# EAGLE design ESP32-S2_VoiceModulator (EAGLE 9.6.2)

## Sheet 1 of 4: ESP32-S2
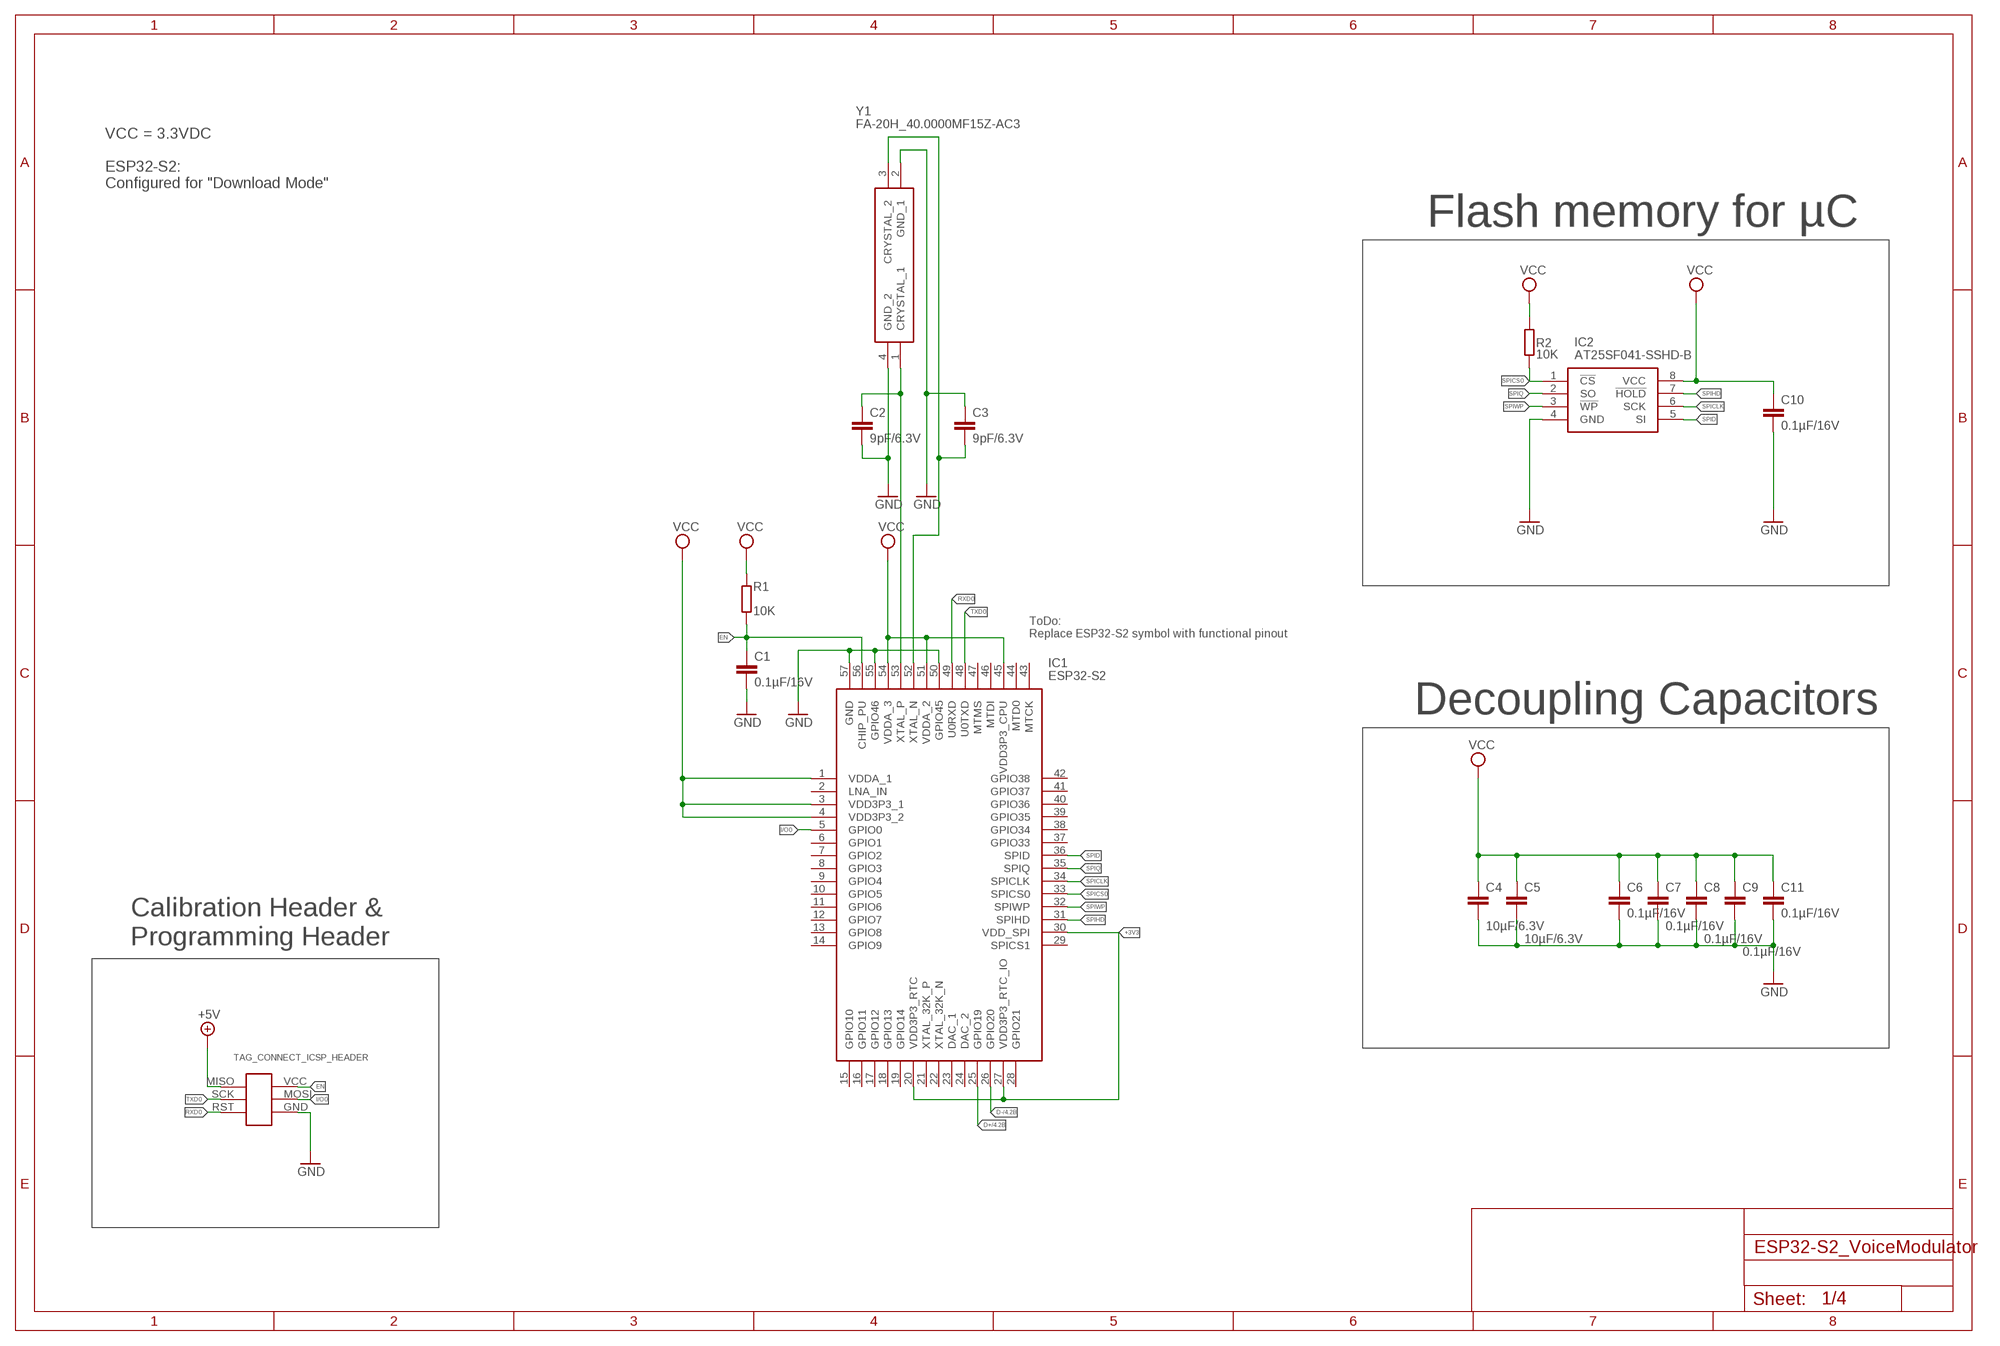
[diagram p0: schematic, sheet 1]

### Parts
C1  0.1µF/16V  C-EUC0402  [C0402]
C2  9pF/6.3V  C-EUC0603  [C0603]
C3  9pF/6.3V  C-EUC0603  [C0603]
C4  10µF/6.3V  C-EUC0603  [C0603]
C5  10µF/6.3V  C-EUC0603  [C0603]
C6  0.1µF/16V  C-EUC0402  [C0402]
C7  0.1µF/16V  C-EUC0402  [C0402]
C8  0.1µF/16V  C-EUC0402  [C0402]
C9  0.1µF/16V  C-EUC0402  [C0402]
C10  0.1µF/16V  C-EUC0402  [C0402]
C11  0.1µF/16V  C-EUC0402  [C0402]
IC1  ESP32-S2  [QFN40P700X700X90-57N]
IC2  AT25SF041-SSHD-B  [SOIC127P600X175-8N]
R1  10K  R-EU_R0603  [R0603]
R2  10K  R-EU_R0603  [R0603]
TAG_CONNECT_ICSP_HEADER  TAG-CONNECT_PADS  [TAG-CONNECT_PADS]
Y1  FA-20H_40.0000MF15Z-AC3  [FA20H160000MF12ZAC3]

### Nets
+3V3: IC1.20(VDD3P3_RTC) IC1.27(VDD3P3_RTC_IO) IC1.30(VDD_SPI)
+5V: TAG_CONNECT_ICSP_HEADER.MISO ; also sheet 3,4
D+: IC1.25(GPIO19) ; also sheet 4
D-: IC1.26(GPIO20) ; also sheet 4
EN: C1.1 IC1.56(CHIP_PU) R1.1 TAG_CONNECT_ICSP_HEADER.VCC
GND: C1.2 C2.2 C3.1 C4.2 C5.2 C6.2 C7.2 C8.2 C9.2 C10.2 C11.2 IC1.50(GPIO45) IC1.55(GPIO46) IC1.57(GND) IC2.4(GND) TAG_CONNECT_ICSP_HEADER.GND Y1.2(GND_1) Y1.4(GND_2) ; also sheet 2,3,4
I/O0: IC1.5(GPIO0) TAG_CONNECT_ICSP_HEADER.MOSI
N$32: C2.1 IC1.53(XTAL_P) Y1.1(CRYSTAL_1)
N$33: C3.2 IC1.52(XTAL_N) Y1.3(CRYSTAL_2)
RXD0: IC1.49(U0RXD) TAG_CONNECT_ICSP_HEADER.RST
SPICLK: IC1.34(SPICLK) IC2.6(SCK)
SPICS0: IC1.33(SPICS0) IC2.1(!CS) R2.1
SPID: IC1.36(SPID) IC2.5(SI)
SPIHD: IC1.31(SPIHD) IC2.7(!HOLD)
SPIQ: IC1.35(SPIQ) IC2.2(SO)
SPIWP: IC1.32(SPIWP) IC2.3(!WP)
TXD0: IC1.48(U0TXD) TAG_CONNECT_ICSP_HEADER.SCK
VCC: C4.1 C5.1 C6.1 C7.1 C8.1 C9.1 C10.1 C11.1 IC1.1(VDDA_1) IC1.3(VDD3P3_1) IC1.4(VDD3P3_2) IC1.45(VDD3P3_CPU) IC1.51(VDDA_2) IC1.54(VDDA_3) IC2.8(VCC) R1.2 R2.2 ; also sheet 3,4
Unconnected: IC1.2(LNA_IN) IC1.6(GPIO1) IC1.7(GPIO2) IC1.8(GPIO3) IC1.9(GPIO4) IC1.10(GPIO5) IC1.11(GPIO6) IC1.12(GPIO7) IC1.13(GPIO8) IC1.14(GPIO9) IC1.15(GPIO10) IC1.16(GPIO11) IC1.17(GPIO12) IC1.18(GPIO13) IC1.19(GPIO14) IC1.21(XTAL_32K_P) IC1.22(XTAL_32K_N) IC1.23(DAC_1) IC1.24(DAC_2) IC1.28(GPIO21) IC1.29(SPICS1) IC1.37(GPIO33) IC1.38(GPIO34) IC1.39(GPIO35) IC1.40(GPIO36) IC1.41(GPIO37) IC1.42(GPIO38) IC1.43(MTCK) IC1.44(MTD0) IC1.46(MTDI) IC1.47(MTMS)

### Notes on the sheet
- VCC = 3.3VDC
  
  ESP32-S2:
  Configured for "Download Mode"
- Flash memory for µC
- ToDo:
  Replace ESP32-S2 symbol with functional pinout
- Decoupling Capacitors
- Calibration Header & 
  Programming Header

## Sheet 2 of 4: Analog
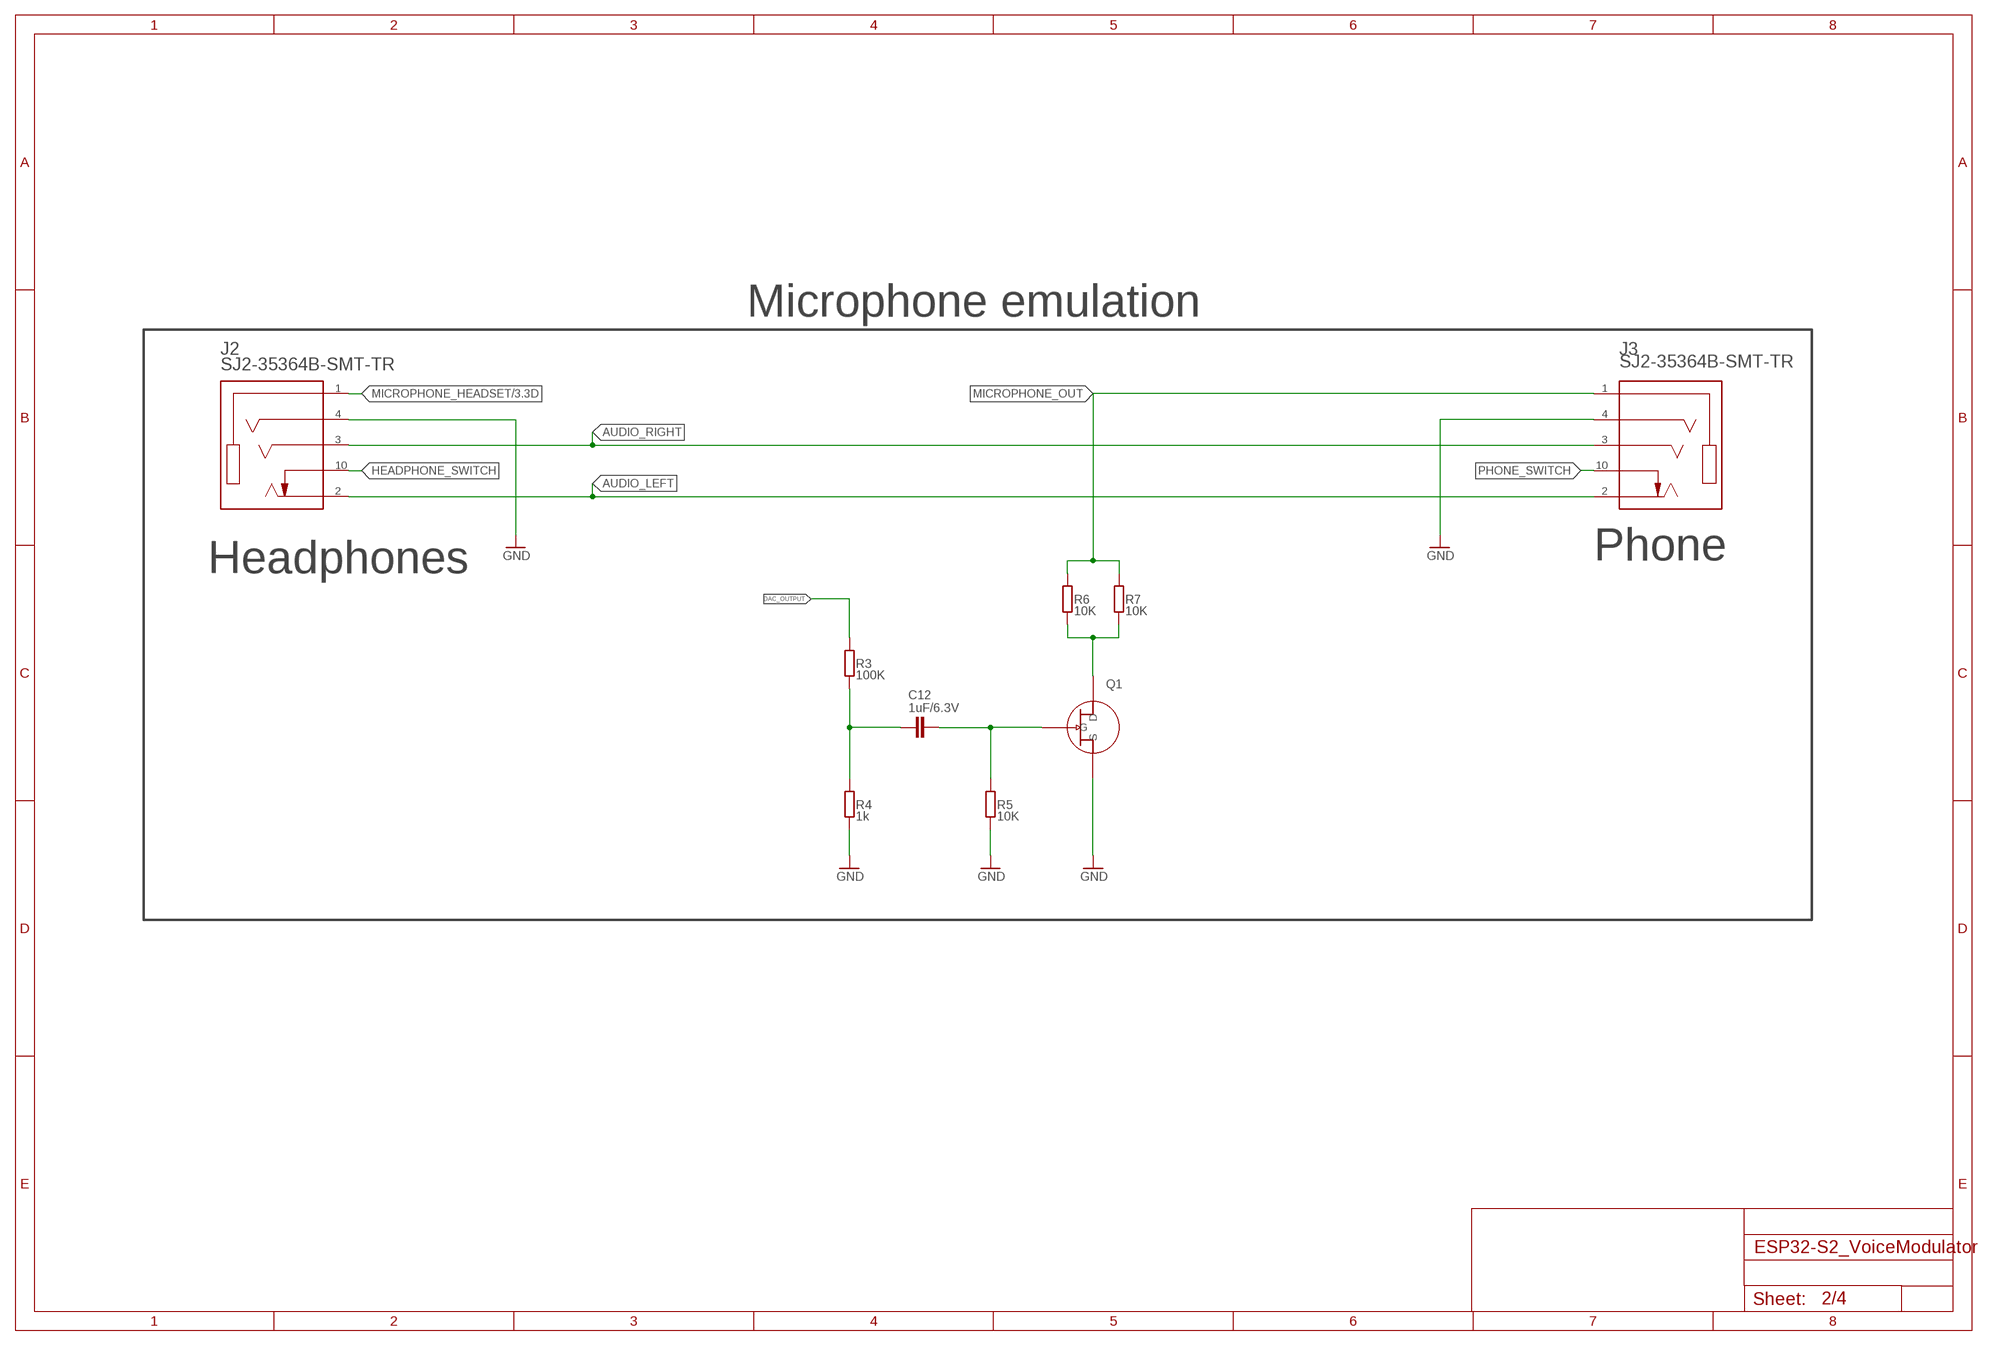
[diagram p1: schematic, sheet 2]

### Parts
C12  1uF/6.3V  C-EUC0603  [C0603]
J2  SJ2-35364B-SMT-TR  [SJ2-35364B-SMT-TR]
J3  SJ2-35364B-SMT-TR  [SJ2-35364B-SMT-TR]
Q1  CPH3910  [SOT-23-3]
R3  100K  R-EU_R0603  [R0603]
R4  1k  R-EU_R0603  [R0603]
R5  10K  R-EU_R0603  [R0603]
R6  10K  R-EU_R0603  [R0603]
R7  10K  R-EU_R0603  [R0603]

### Nets
AUDIO_LEFT: J2.2 J3.2
AUDIO_RIGHT: J2.3 J3.3
DAC_OUTPUT: R3.2
GND: J2.4 J3.4 Q1.P$1(S) R4.1 R5.2 ; also sheet 1,3,4
HEADPHONE_SWITCH: J2.10
MICROPHONE_HEADSET: J2.1 ; also sheet 3
MICROPHONE_OUT: J3.1 R6.1 R7.2
N$1: C12.2 Q1.P$3(G) R5.1
N$2: C12.1 R3.1 R4.2
N$5: Q1.P$2(D) R6.2 R7.1
PHONE_SWITCH: J3.10

### Notes on the sheet
- Microphone emulation
- Headphones | Phone

## Sheet 3 of 4: Microphone
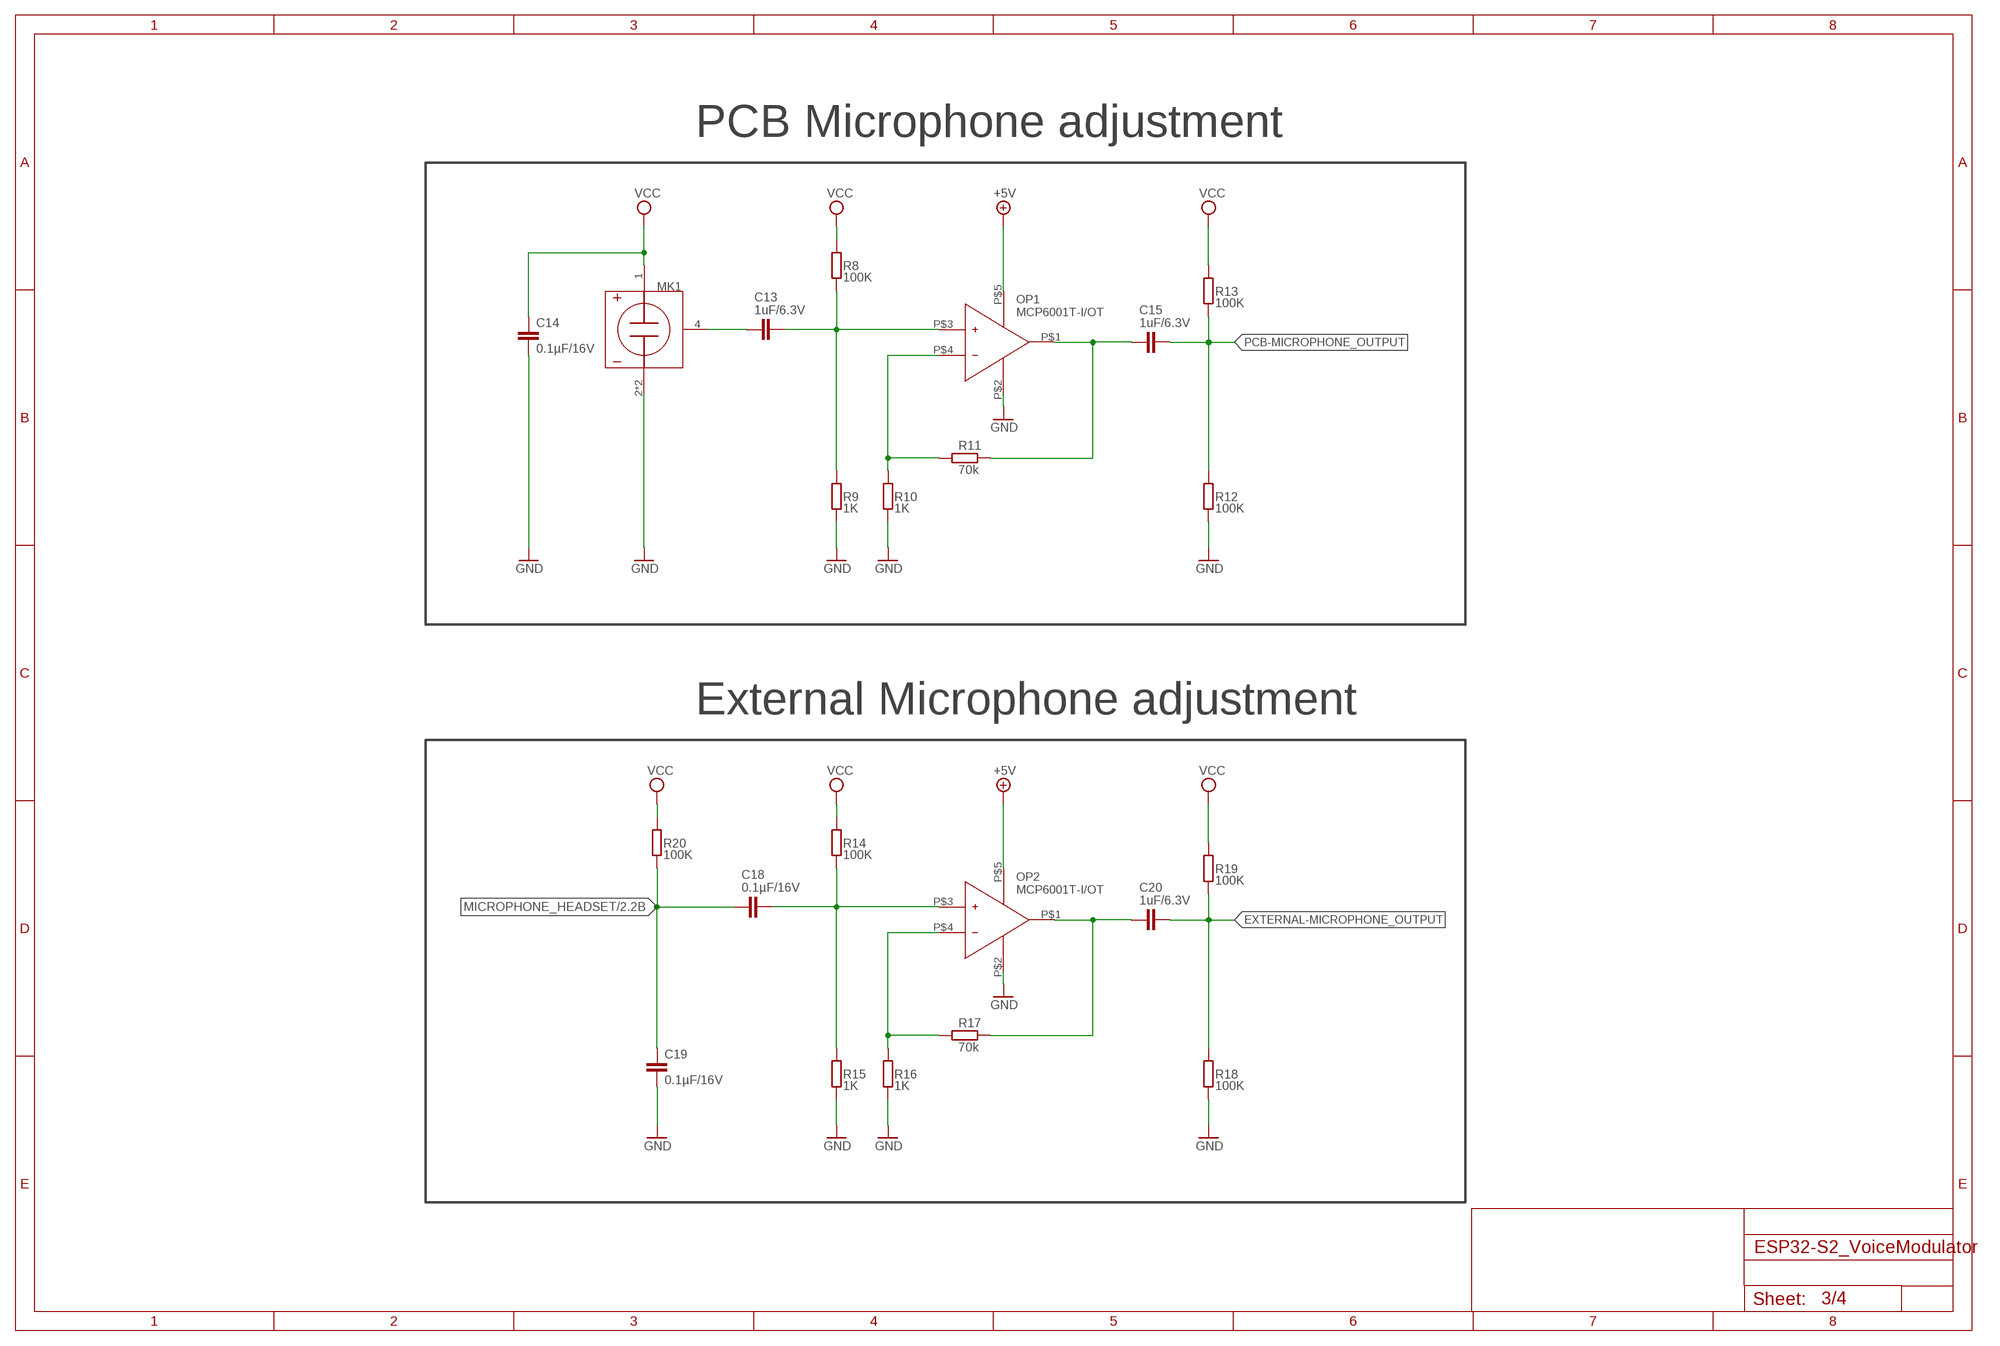
[diagram p2: schematic, sheet 3]

### Parts
C13  1uF/6.3V  C-EUC0603  [C0603]
C14  0.1µF/16V  C-EUC0402  [C0402]
C15  1uF/6.3V  C-EUC0603  [C0603]
C18  0.1µF/16V  C-EUC0603  [C0603]
C19  0.1µF/16V  C-EUC0402  [C0402]
C20  1uF/6.3V  C-EUC0603  [C0603]
MK1  WMM7022AT0  [WMM7022AT0]
OP1  MCP6001T-I/OT  [SOT-23-5]
OP2  MCP6001T-I/OT  [SOT-23-5]
R8  100K  R-EU_R0603  [R0603]
R9  1K  R-EU_R0603  [R0603]
R10  1K  R-EU_R0603  [R0603]
R11  70k  R-EU_R0603  [R0603]
R12  100K  R-EU_R0603  [R0603]
R13  100K  R-EU_R0603  [R0603]
R14  100K  R-EU_R0603  [R0603]
R15  1K  R-EU_R0603  [R0603]
R16  1K  R-EU_R0603  [R0603]
R17  70k  R-EU_R0603  [R0603]
R18  100K  R-EU_R0603  [R0603]
R19  100K  R-EU_R0603  [R0603]
R20  100K  R-EU_R0603  [R0603]

### Nets
+5V: OP1.P$5(VDD) OP2.P$5(VDD) ; also sheet 1,4
EXTERNAL-MICROPHONE_OUTPUT: C20.2 R18.2 R19.1
GND: C14.2 C19.2 MK1.2(GND) MK1.3(GND) OP1.P$2(VSS) OP2.P$2(VSS) R9.1 R10.1 R12.1 R15.1 R16.1 R18.1 ; also sheet 1,2,4
MICROPHONE_HEADSET: C18.1 C19.1 R20.1 ; also sheet 2
N$3: C13.2 OP1.P$3(V+) R8.1 R9.2
N$4: C13.1 MK1.4(OUT)
N$6: OP1.P$4(V-) R10.2 R11.2
N$7: C15.1 OP1.P$1(VOUT) R11.1
N$9: C18.2 OP2.P$3(V+) R14.1 R15.2
N$10: OP2.P$4(V-) R16.2 R17.2
N$11: C20.1 OP2.P$1(VOUT) R17.1
PCB-MICROPHONE_OUTPUT: C15.2 R12.2 R13.1
VCC: C14.1 MK1.1(VDD) R8.2 R13.2 R14.2 R19.2 R20.2 ; also sheet 1,4

### Notes on the sheet
- PCB Microphone adjustment
- External Microphone adjustment

## Sheet 4 of 4: Power
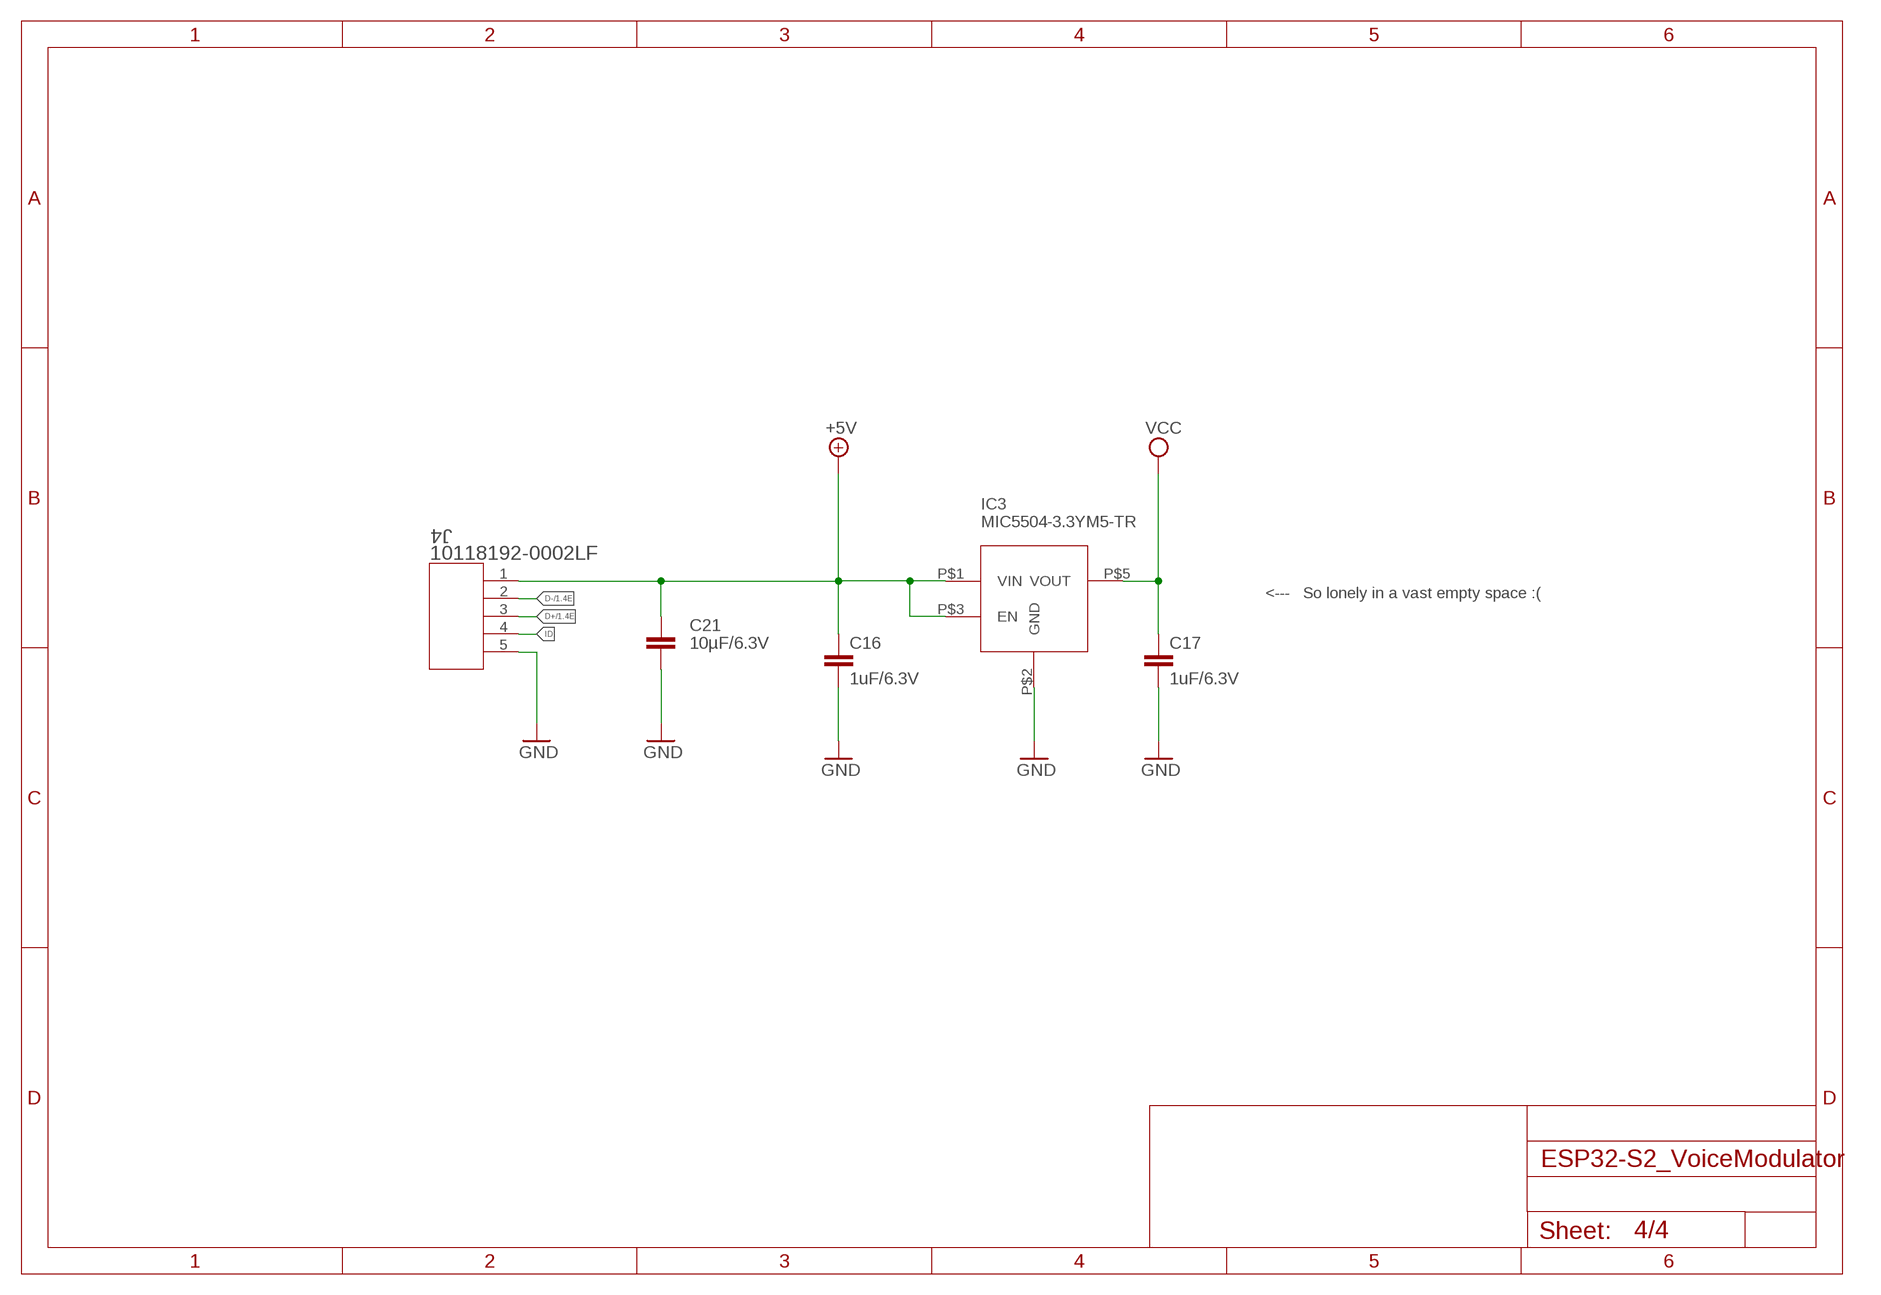
[diagram p3: schematic, sheet 4]

### Parts
C16  1uF/6.3V  C-EUC0603  [C0603]
C17  1uF/6.3V  C-EUC0603  [C0603]
C21  10µF/6.3V  C-EUC0603  [C0603]
IC3  MIC5504-3.3YM5-TR  [SOT-23-5]
J4  10118192-0002LF  [CONN_10118192-0002LF_AMP]

### Nets
+5V: C16.1 C21.1 IC3.P$1(VIN) IC3.P$3(EN) J4.1 ; also sheet 1,3
D+: J4.3 ; also sheet 1
D-: J4.2 ; also sheet 1
GND: C16.2 C17.2 C21.2 IC3.P$2(GND) J4.5 ; also sheet 1,2,3
ID: J4.4
VCC: C17.1 IC3.P$5(VOUT) ; also sheet 1,3

### Notes on the sheet
- <---   So lonely in a vast empty space :(

## Library data of the parts
C1-C11 C14 C19 C21 = rcl:C-EU: CAPACITOR, European symbol; SPICEPREFIX: C
C12 C13 C15-C18 C20 = resistor:C-EU: CAPACITOR, European symbol
IC1 = SamacSys_Parts:ESP32-S2: SMD WI-FI IC, ESP32-S2, SINGAL-C Source: Datasheet <https://componentsearchengine.com/Datasheets/1/ESP32-S2.pdf>; ARROW_PART_NUMBER: ESP32-S2; DESCRIPTION: SMD WI-FI IC, ESP32-S2, SINGAL-C; HEIGHT: 0.9mm; MANUFACTURER_NAME: Espressif Systems; MANUFACTURER_PART_NUMBER: ESP32-S2; MOUSER_PART_NUMBER: 356-ESP32-S2; MOUSER_PRICE-STOCK: https://www.mouser.co.uk/ProductDetail/Espressif-Systems/ESP32-S2?qs=GBLSl2Akirtmlui%2FgtDaSQ%3D%3D
IC2 = SamacSys_Parts:AT25SF041-SSHD-B: 4-Mbit 2.5V SPI Flash Memory Source: Datasheet <http://uk.rs-online.com/web/p/products/8228473P>; ARROW_PART_NUMBER: AT25SF041-SSHD-B; ARROW_PRICE-STOCK: https://www.arrow.com/en/products/at25sf041-sshd-b/adesto-technologies-corporation-inc; DESCRIPTION: 4-Mbit 2.5V SPI Flash Memory; HEIGHT: 1.75mm; MANUFACTURER_NAME: Adesto Technologies; MANUFACTURER_PART_NUMBER: AT25SF041-SSHD-B; MOUSER_PART_NUMBER: 988-AT25SF041-SSHD-B; MOUSER_PRICE-STOCK: https://www.mouser.co.uk/ProductDetail/Adesto-Technologies/AT25SF041-SSHD-B?qs=abmNkq9no6AMaDbJMT3DtA%3D%3D
IC3 = VoiceModulator:MIC5504-3.3YM5-TR: Linear Voltage Regulator IC 1 Output 300mA SOT-23-5
J2 = VoiceModulator:SJ2-35364B-SMT-TR: 3.5 mm, Stereo, Right Angle, Surface Mount (SMT), Audio Jack Connector Check prices; SPICEPREFIX: X
J3 = VoiceModulator:SJ2-35364B-SMT-TR: 3.5 mm, Stereo, Right Angle, Surface Mount (SMT), Audio Jack Connector Check prices
J4 = VoiceModulator:10118192-0002LF; BUILT_BY: EMA_Cory; COPYRIGHT: Copyright (C) 2018 Accelerated Designs. All rights reserved; DATASHEET: https://www.amphenol-icc.com/media/wysiwyg/files/drawing/10118192.pdf; MANUFACTURER_PART_NUMBER: 10118192-0002LF; SOURCELIBRARY: Amphenol_ICC_2020-05-19; VENDOR: Amphenol
MK1 = VoiceModulator:WMM7022AT0: 3.76*2.24*1.1 Electret Condenser Microphone RoHS
OP1 OP2 = VoiceModulator:MCP6001T-I/OT: General Purpose Amplifier 1 Circuit Rail-to-Rail SOT-23-5
Q1 = VoiceModulator:CPH3910: JFET N-Channel 25V 50mA 400mW Surface Mount 3-CPH
R1-R20 = resistor:R-EU_: RESISTOR, European symbol
TAG_CONNECT_ICSP_HEADER = TAG-CONNECT_PADS-lbr:TAG-CONNECT_PADS
Y1 = SamacSys_Parts:FA-20H_40.0000MF15Z-AC3: Source: Datasheet <https://support.epson.biz/td/api/doc_check.php?dl=brief_FA-20H&lang=en>; HEIGHT: 0.55mm; MANUFACTURER_NAME: Epson Timing; MANUFACTURER_PART_NUMBER: FA-20H 40.0000MF15Z-AC3; MOUSER_PART_NUMBER: 732-FA-20H40F15Z-AC3; MOUSER_PRICE-STOCK: https://www.mouser.com/Search/Refine.aspx?Keyword=732-FA-20H40F15Z-AC3

## Board
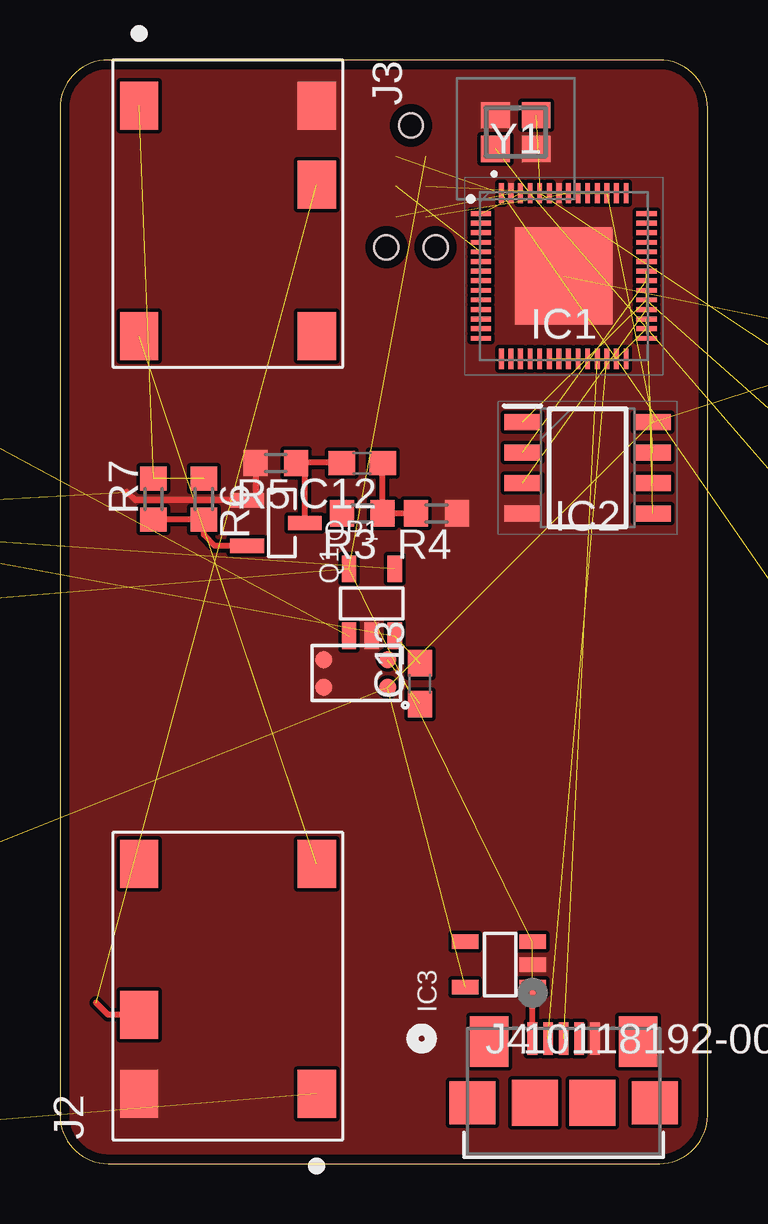
[diagram p4: board, top side]
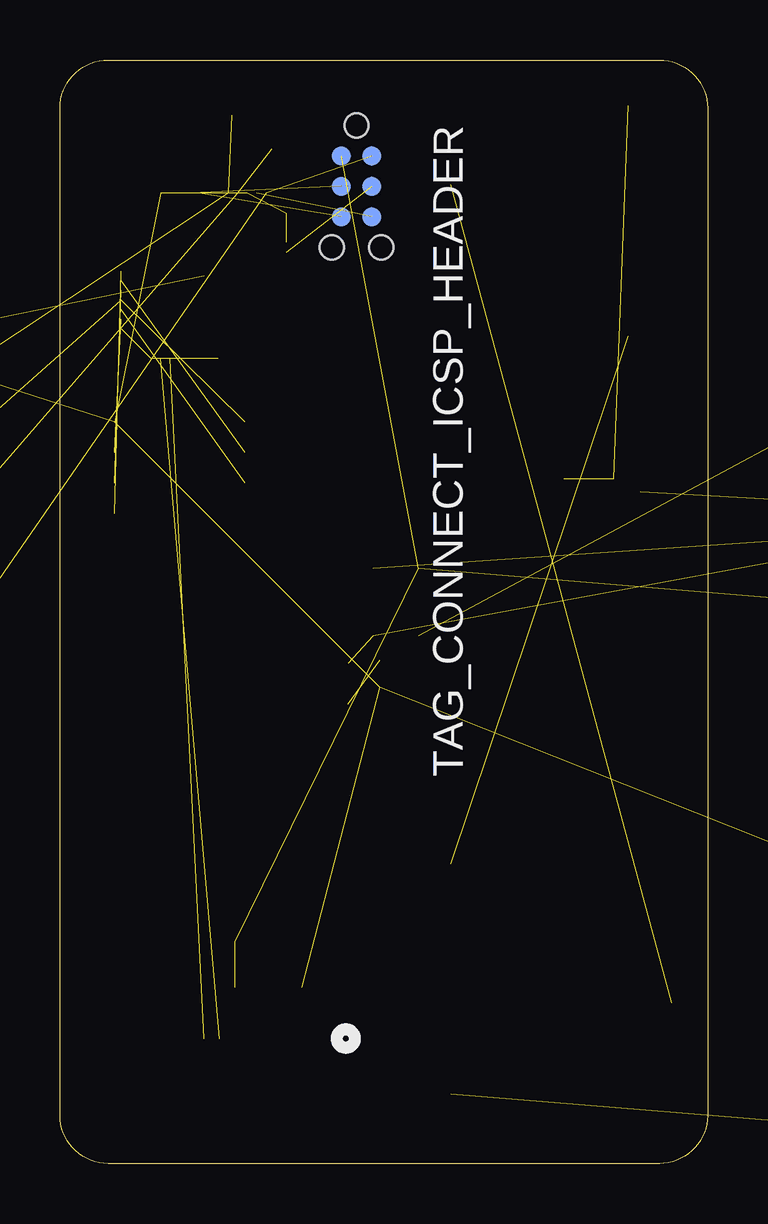
[diagram p5: board, bottom side, seen from below]

Size 27 x 46 mm. Coordinates in mm from the lower left corner, seen from the top.
Outline: 0,44 0,2 arc90 2,0 25,0 arc90 27,2 27,44 arc90 25,46 2,46 arc90 0,44
Copper layers (1+2*15+16): Top 0.035mm / dielectric 0.2mm / Route2 0.035mm / dielectric 1.5mm / Route15 0.035mm / dielectric 0.2mm / Bottom 0.035mm
Design rules "default *": minimum track width 6mil, minimum drill 0.35mm, track to track 6mil, track to pad 6mil, pad to pad 6mil, via to via 6mil, smd to smd 6mil, copper to edge 15mil, drill to drill 6mil, minimum pad ring 10mil, minimum via ring 8mil, stop-mask expansion 4mil, vias tented up to drill 20mil, thermal gap 10mil

### Footprints (pad centres in the part's own frame; a part is rotated, then mirrored left to right if it is on the bottom)
C0402 = smd 0.7 x 0.9: 1 -0.65,0; 2 0.65,0
C0603 = smd 1.1 x 1: 1 -0.85,0; 2 0.85,0
QFN40P700X700X90-57N = smd 0.85 x 0.2: 1 -3.45,2.6; 2 -3.45,2.2; 3 -3.45,1.8; 4 -3.45,1.4; 5 -3.45,1; 6 -3.45,0.6; 7 -3.45,0.2; 8 -3.45,-0.2; 9 -3.45,-0.6; 10 -3.45,-1; 11 -3.45,-1.4; 12 -3.45,-1.8; 13 -3.45,-2.2; 14 -3.45,-2.6; 29 3.45,-2.6; 30 3.45,-2.2; 31 3.45,-1.8; 32 3.45,-1.4; 33 3.45,-1; 34 3.45,-0.6; 35 3.45,-0.2; 36 3.45,0.2; 37 3.45,0.6; 38 3.45,1; 39 3.45,1.4; 40 3.45,1.8; 41 3.45,2.2; 42 3.45,2.6 | smd 0.2 x 0.85: 15 -2.6,-3.45; 16 -2.2,-3.45; 17 -1.8,-3.45; 18 -1.4,-3.45; 19 -1,-3.45; 20 -0.6,-3.45; 21 -0.2,-3.45; 22 0.2,-3.45; 23 0.6,-3.45; 24 1,-3.45; 25 1.4,-3.45; 26 1.8,-3.45; 27 2.2,-3.45; 28 2.6,-3.45; 43 2.6,3.45; 44 2.2,3.45; 45 1.8,3.45; 46 1.4,3.45; 47 1,3.45; 48 0.6,3.45; 49 0.2,3.45; 50 -0.2,3.45; 51 -0.6,3.45; 52 -1,3.45; 53 -1.4,3.45; 54 -1.8,3.45; 55 -2.2,3.45; 56 -2.6,3.45 | smd 4.05 x 4.05: 57 0,0
SOIC127P600X175-8N = smd 1.525 x 0.65: 1 -2.712,1.905; 2 -2.712,0.635; 3 -2.712,-0.635; 4 -2.712,-1.905; 5 2.712,-1.905; 6 2.712,-0.635; 7 2.712,0.635; 8 2.712,1.905
SOT-23-5 = smd 0.6 x 1.1: P$1 -0.95,0; P$2 0,0; P$3 0.95,0; P$4 0.95,2.8; P$5 -0.95,2.8
SJ2-35364B-SMT-TR = smd 2 x 1.6: 1 1.9,-3.7; 2 11.5,-3.7; 3 5.2,3.7; 4 1.9,3.7; 10 11.5,3.7
CONN_10118192-0002LF_AMP = smd 0.406 x 1.346: 1 -1.3,2.204; 2 -0.65,2.204; 3 0,2.204; 4 0.65,2.204; 5 1.3,2.204 | smd 1.6 x 2.108: 6 -3.1,2.079; 7 3.1,2.079 | smd 1.905 x 1.803: 8 -3.8,-0.471; 9 3.8,-0.471 | smd 1.905 x 1.905: 10 -1.2,-0.471; 11 1.2,-0.471
WMM7022AT0 = smd 0.7 x 0.7: 1 1.15,2.66; 2 1.15,0; 3 0,0; 4 0,2.66
SOT-23-3 = smd 0.6 x 1.4: P$1 -0.95,0; P$2 0.95,0; P$3 0,2.4
R0603 = smd 1 x 1.1: 1 -0.85,0; 2 0.85,0
TAG-CONNECT_PADS = smd 0.787 x 0.787: GND 2.54,0; MISO 0,-1.27; MOSI 1.27,0; RST 2.54,-1.27; SCK 1.27,-1.27; VCC 0,0 | hole 0.991: -1.27,-0.635; 3.81,0.394; 3.81,-1.664
FA20H160000MF12ZAC3 = smd 1.2 x 1.1: 1 -0.85,-0.7; 2 0.85,-0.7; 3 0.85,0.7; 4 -0.85,0.7

### Placement (x,y rotation side)
C1  36,16 0 top  (outside the outline)
C2  52,4 0 top  (outside the outline)
C3  50,20 0 top  (outside the outline)
C4  50,40 0 top  (outside the outline)
C5  44,39 0 top  (outside the outline)
C6  50,25 0 top  (outside the outline)
C7  50,35 0 top  (outside the outline)
C8  35,34 0 top  (outside the outline)
C9  50,30 0 top  (outside the outline)
C10  44,34 0 top  (outside the outline)
C11  71,40 0 top  (outside the outline)
C12  12.6,29.2 180 top
C13  15,20 90 top
C14  -20,44 0 top  (outside the outline)
C15  -15,37 0 top  (outside the outline)
C16  -19,54 0 top  (outside the outline)
C17  -19,49 0 top  (outside the outline)
C18  -24,15 0 top  (outside the outline)
C19  -20,22 0 top  (outside the outline)
C20  -15,15 0 top  (outside the outline)
C21  -24,-14 0 top  (outside the outline)
IC1  21,37 0 top
IC2  22,29 0 top
IC3  19.7,8.3 90 top
J2  7,1 90 top
J3  7,46 270 top
J4  21,3 0 top
MK1  11,21 270 top
OP1  13,22 0 top
OP2  -23,19 0 top  (outside the outline)
Q1  7.8,26.7 270 top
R1  57,15 0 top  (outside the outline)
R2  49,15 0 top  (outside the outline)
R3  12.6,27.1 180 top
R4  15.7,27.1 180 top
R5  9,29.2 180 top
R6  6,27.7 270 top
R7  3.9,27.7 90 top
R8  -24,32 0 top  (outside the outline)
R9  -14,27 0 top  (outside the outline)
R10  -24,27 0 top  (outside the outline)
R11  -19,27 0 top  (outside the outline)
R12  -18,32 0 top  (outside the outline)
R13  -12,32 0 top  (outside the outline)
R14  -24,10 0 top  (outside the outline)
R15  -24,5 0 top  (outside the outline)
R16  -19,5 0 top  (outside the outline)
R17  -14,5 0 top  (outside the outline)
R18  -18,10 0 top  (outside the outline)
R19  -12,10 0 top  (outside the outline)
R20  -24,0 0 top  (outside the outline)
TAG_CONNECT_ICSP_HEADER  14,42 270 bottom
Y1  19,43 0 top

### Tracks (layer width: path | path; a pad name or v marks a point on that pad's centre or on a via)
+3V3  (2 unrouted)
+5V  (6 unrouted)
  Top 0.254: J4.1 IC3.P$1
AUDIO_LEFT  (1 unrouted)
AUDIO_RIGHT  (1 unrouted)
  Top 0.254: J2.3 2,6.2 1.5,6.7
D+  (1 unrouted)
D-  (1 unrouted)
EN  (3 unrouted)
EXTERNAL-MICROPHONE_OUTPUT  (2 unrouted)
GND  (24 unrouted)
  Top 0.254: R5.2 8.15,27.65 | Q1.P$1 3.15,27.65 2.8,28
  pour Top (rank 3, no thermals): -1,-1 -1,47 28,47 28,-1
I/O0  (1 unrouted)
MICROPHONE_HEADSET  (3 unrouted)
MICROPHONE_OUT  (2 unrouted)
N$1
  Top 0.254: Q1.P$3 10.2,28.85 R5.1 9.82,29.23 11.72,29.23 C12.2
N$2
  Top 0.254: C12.1 R3.1 R4.2
N$3  (3 unrouted)
N$4  (1 unrouted)
N$5
  Top 0.254: R7.1 R6.2 6,26.2 6.45,25.75 Q1.P$2
N$6  (2 unrouted)
N$7  (2 unrouted)
N$9  (3 unrouted)
N$10  (2 unrouted)
N$11  (2 unrouted)
N$32  (2 unrouted)
N$33  (2 unrouted)
PCB-MICROPHONE_OUTPUT  (2 unrouted)
RXD0  (1 unrouted)
SPICLK  (1 unrouted)
SPICS0  (2 unrouted)
SPID  (1 unrouted)
SPIHD  (1 unrouted)
SPIQ  (1 unrouted)
SPIWP  (1 unrouted)
TXD0  (1 unrouted)
VCC  (25 unrouted)